# EAGLE design cataclysm-TOP (EAGLE 9.6.1)
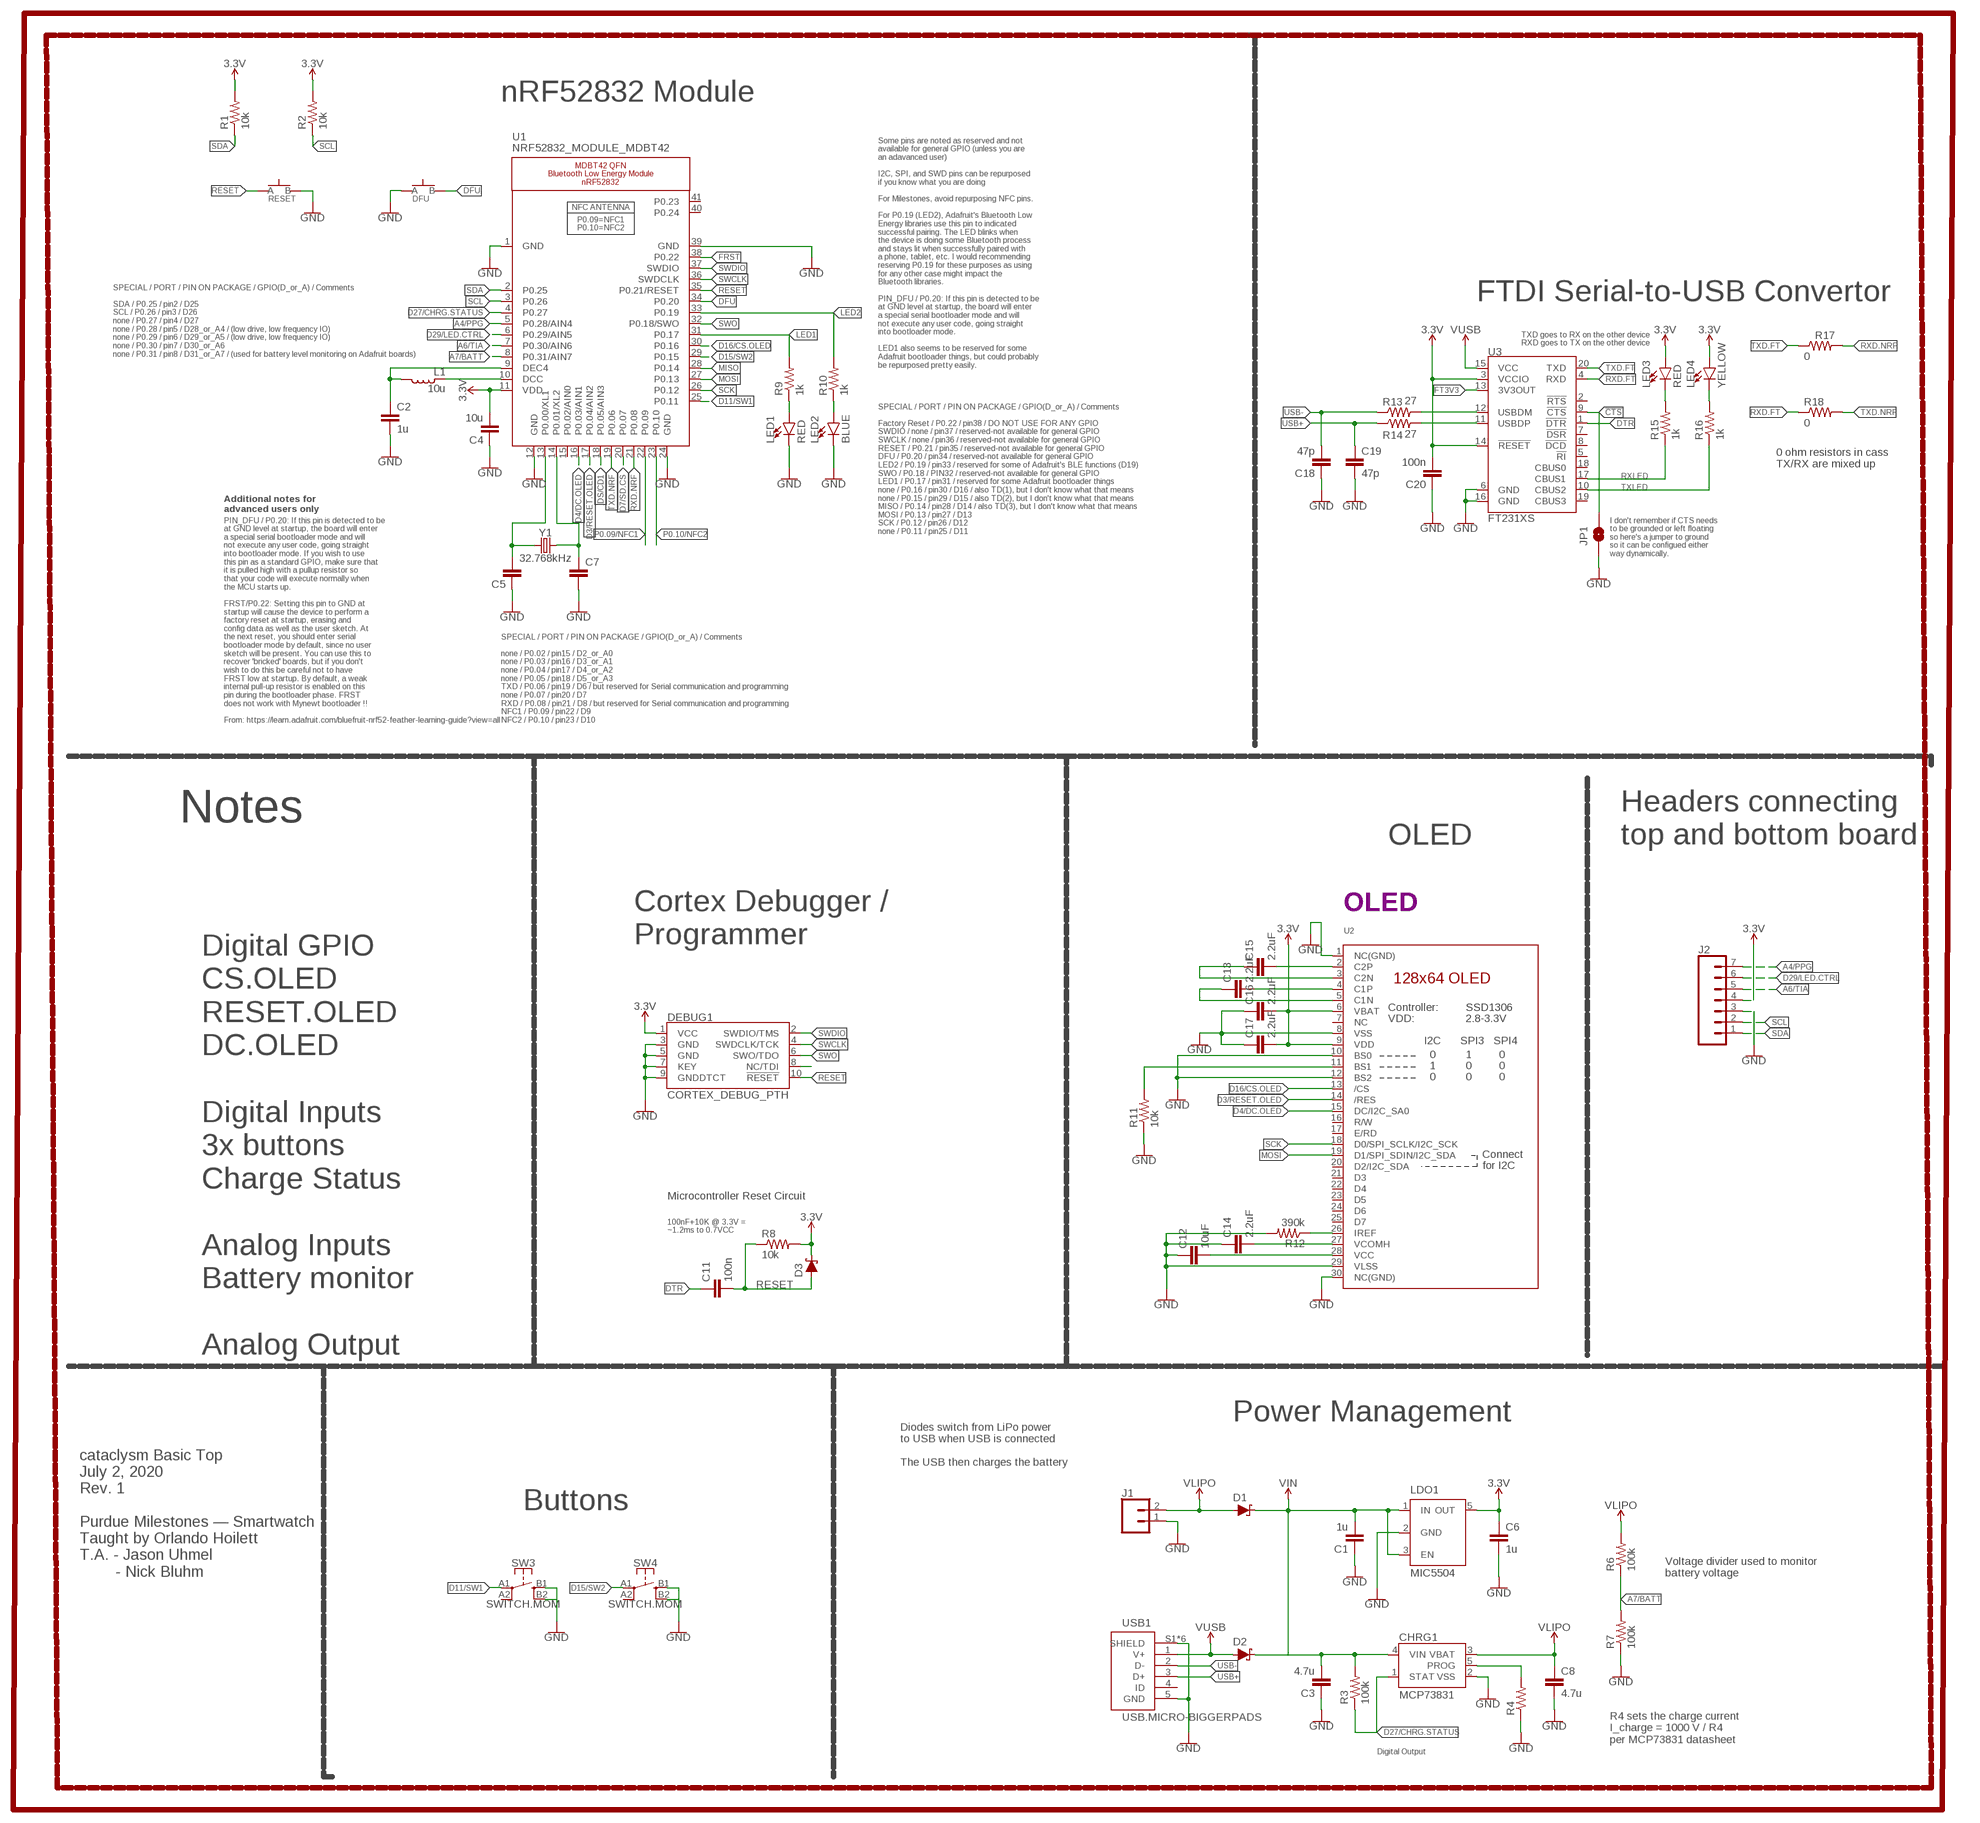
[diagram p0: schematic, sheet 1]

## Parts
C1  1u  CAPACITOR0603  [C0603]
C2  1u  CAPACITOR0603  [C0603]
C3  4.7u  CAPACITOR0603  [C0603]
C4  10u  CAPACITOR0805  [C0805]
C5  CAPACITOR0603  [C0603]
C6  1u  CAPACITOR0603  [C0603]
C7  CAPACITOR0603  [C0603]
C8  4.7u  CAPACITOR0603  [C0603]
C11  100n  CAPACITOR0603  [C0603]
C12  10uF  CAPACITOR0603  [C0603]
C13  2.2uF  CAPACITOR0402  [C0402]
C14  2.2uF  CAPACITOR0603  [C0603]
C15  2.2uF  CAPACITOR0402  [C0402]
C16  2.2uF  CAPACITOR0402  [C0402]
C17  2.2uF  CAPACITOR0402  [C0402]
C18  47p  CAPACITOR0603  [C0603]
C19  47p  CAPACITOR0603  [C0603]
C20  100n  CAPACITOR0603  [C0603]
CHRG1  MCP73831  [SOT23-5]
D1  SCHOTTKY-USC  [USC]
D2  SCHOTTKY-USC  [USC]
D3  SCHOTTKY-USC  [USC]
DEBUG1  CORTEX_DEBUG_PTH  [2X5-PTH-1.27MM]
DFU  SPST-PTS830GG140-COPY.1-3  [BUTTON-GULLWING]
J1  CONN_02  [1X02]
J2  CONN_07-1.27MM  [1X07_1.27MM]
JP1  JUMPER-SMT_2_NO_SILK  [SMT-JUMPER_2_NO_SILK]
L1  10u  INDUCTOR0603  [L0603]
LDO1  MIC5504  [SOT23-5]
LED1  RED  LED0603  [LED-0603]
LED2  BLUE  LED0603  [LED-0603]
LED3  RED  LED0603  [LED-0603]
LED4  YELLOW  LED0603  [LED-0603]
R1  10k  RESISTOR0603  [R0603]
R2  10k  RESISTOR0603  [R0603]
R3  100k  RESISTOR0603  [R0603]
R4  RESISTOR0603  [R0603]
R6  100k  RESISTOR0603  [R0603]
R7  100k  RESISTOR0603  [R0603]
R8  10k  RESISTOR0603  [R0603]
R9  1k  RESISTOR0603  [R0603]
R10  1k  RESISTOR0603  [R0603]
R11  10k  RESISTOR0603  [R0603]
R12  390k  RESISTOR0603  [R0603]
R13  27  RESISTOR0603  [R0603]
R14  27  RESISTOR0603  [R0603]
R15  1k  RESISTOR0603  [R0603]
R16  1k  RESISTOR0603  [R0603]
R17  0  RESISTOR0603  [R0603]
R18  0  RESISTOR0603  [R0603]
RESET  SPST-PTS830GG140-COPY.1-3  [BUTTON-GULLWING]
SW3  SWITCH.MOM  [TACTILE_SWITCH_SMD_6.2MM_TALL]
SW4  SWITCH.MOM  [TACTILE_SWITCH_SMD_6.2MM_TALL]
U1  NRF52832_MODULE_MDBT42  [BLE_MODULE_RAYTAC_MDBT42]
U2  DISP_OLED_UG-2864HSWEG01-NO-WRAPAROUND  [UG-2864HSWEG01_0.96IN_NO-WRAPAROUND]
U3  FT231XS  [SSOP20_L]
USB1  USB.MICRO-BIGGERPADS  [USB-MICRO-01.BIGGERPADS]
Y1  32.768kHz  CRYSTALECS-.327-12.5-12-C-TR  [2-SMD.NOLEAD.2.0MMTO1.2MM]

## Nets
3.3V: C4.2 C6.1 C16.2 C17.2 C20.2 D3.-(C) DEBUG1.1(VCC) J2.4 LDO1.5(OUT) LED3.A LED4.A R1.2 R2.2 R8.2 U1.11(VDD) U2.6(VBAT) U2.9(VDD) U3.3(VCCIO) U3.14(!RESET)
!CTS: JP1.2 U3.9(!CTS)
A4/PPG: J2.7 U1.5(P0.28/AIN4)
A6/TIA: J2.5 U1.7(P0.30/AIN6)
A7/BATT: R6.1 R7.2 U1.8(P0.31/AIN7)
D3/RESET.OLED: U1.17(P0.04/AIN2) U2.14(/RES)
D4/DC.OLED: U1.16(P0.03/AIN1) U2.15(DC/I2C_SA0)
D7/SD.CS: U1.20(P0.07)
D11/SW1: SW3.A1 U1.25(P0.11)
D15/SW2: SW4.A1 U1.29(P0.15)
D16/CS.OLED: U1.30(P0.16) U2.13(/CS)
D27/CHRG.STATUS: CHRG1.1(STAT) R3.1 U1.4(P0.27)
D29/LED.CTRL: J2.6 U1.6(P0.29/AIN5)
DFU: DFU.3(B) U1.34(P0.20)
DS/CD1: U1.18(P0.05/AIN3)
DTR: C11.1 U3.1(!DTR)
FRST: U1.38(P0.22)
FT3V3: U3.13(3V3OUT)
GND: C1.1 C2.2 C3.1 C4.1 C5.1 C6.2 C7.2 C8.2 C12.1 C14.1 C16.1 C17.1 C18.1 C19.2 C20.1 CHRG1.2(VSS) DEBUG1.3(GND) DEBUG1.5(GND) DEBUG1.7(KEY) DEBUG1.9(GNDDTCT) DFU.1(A) J1.1 J2.3 JP1.1 LDO1.2(GND) LED1.C LED2.C R4.1 R7.1 R11.1 R12.2 RESET.3(B) SW3.B1 SW4.B1 U1.1(GND) U1.12(GND) U1.24(GND) U1.39(GND) U2.1(NC(GND)) U2.8(VSS) U2.10(BS0) U2.12(BS2) U2.29(VLSS) U2.30(NC(GND)) U3.6(GND) U3.16(GND) USB1.5(GND) USB1.S1(SHIELD) USB1.S2(SHIELD) USB1.S3(SHIELD) USB1.S4(SHIELD) USB1.S5(SHIELD) USB1.S6(SHIELD)
LED1: R9.2 U1.31(P0.17)
LED2: R10.2 U1.33(P0.19)
MISO: U1.28(P0.14)
MOSI: U1.27(P0.13) U2.19(D1/SPI_SDIN/I2C_SDA)
N$1: R11.2 U2.11(BS1)
N$2: R12.1 U2.26(IREF)
N$3: C15.2 U2.2(C2P)
N$4: C5.2 U1.13(P0.00/XL1) Y1.P$1
N$5: C15.1 U2.3(C2N)
N$6: C7.1 U1.14(P0.01/XL2) Y1.P$2
N$7: C13.2 U2.4(C1P)
N$8: C13.1 U2.5(C1N)
N$9: LED1.A R9.1
N$10: LED2.A R10.1
N$11: L1.1 U1.10(DCC)
N$12: C2.1 L1.2 U1.9(DEC4)
N$13: C12.2 U2.28(VCC)
N$14: DEBUG1.8(NC/TDI)
N$15: C14.2 U2.27(VCOMH)
N$16: SW4.B2
N$17: CHRG1.5(PROG) R4.2
N$21: SW3.B2
N$25: R13.2 U3.12(USBDM)
N$26: R14.2 U3.11(USBDP)
N$27: LED3.C R15.2
N$28: LED4.C R16.2
P0.09/NFC1: U1.22(P0.09)
P0.10/NFC2: U1.23(P0.10)
RESET: C11.2 D3.+(A) DEBUG1.10(!RESET) R8.1 RESET.1(A) U1.35(P0.21/RESET)
RXD.FT: R18.1 U3.4(RXD)
RXD.NRF: R17.2 U1.21(P0.08)
RXLED: R15.1 U3.17(CBUS1)
SCK: U1.26(P0.12) U2.18(D0/SPI_SCLK/I2C_SCK)
SCL: J2.2 R2.1 U1.3(P0.26)
SDA: J2.1 R1.1 U1.2(P0.25)
SWCLK: DEBUG1.4(SWDCLK/TCK) U1.36(SWDCLK)
SWDIO: DEBUG1.2(SWDIO/TMS) U1.37(SWDIO)
SWO: DEBUG1.6(SWO/TDO) U1.32(P0.18/SWO)
TXD.FT: R17.1 U3.20(TXD)
TXD.NRF: R18.2 U1.19(P0.06)
TXLED: R16.1 U3.10(CBUS2)
USB+: C19.1 R14.1 USB1.3(D+)
USB-: C18.2 R13.1 USB1.2(D-)
V_USB: D2.+(A) U3.15(VCC) USB1.1(V+) ; supply symbol labelled VUSB
VIN: C1.2 C3.2 CHRG1.4(VIN) D1.-(C) D2.-(C) LDO1.1(IN) LDO1.3(EN) R3.2
VLIPO: C8.1 CHRG1.3(VBAT) D1.+(A) J1.2 R6.2
Unconnected: SW3.A2 SW4.A2 U1.15(P0.02/AIN0) U1.40(P0.24) U1.41(P0.23) U2.7(NC) U2.16(R/W) U2.17(E/RD) U2.20(D2/I2C_SDA) U2.21(D3) U2.22(D4) U2.23(D5) U2.24(D6) U2.25(D7) U3.2(!RTS) U3.5(!RI) U3.7(!DSR) U3.8(!DCD) U3.18(CBUS0) U3.19(CBUS3) USB1.4(ID)

## Notes on the sheet
- nRF52832 Module
- FTDI Serial-to-USB Convertor
- TXD goes to RX on the other device
  RXD goes to TX on the other device
- SPECIAL / PORT / PIN ON PACKAGE / GPIO(D_or_A) / Comments
  
  SDA / P0.25 / pin2 / D25
  SCL / P0.26 / pin3 / D26
  none / P0.27 / pin4 / D27
  none / P0.28 / pin5 / D28_or_A4 / (low drive, low frequency IO)
  none / P0.29 / pin6 / D29_or_A5 / (low drive, low frequency IO)
  none / P0.30 / pin7 / D30_or_A6
  none / P0.31 / pin8 / D31_or_A7 / (used for battery level monitoring on Adafruit boards)
- Some pins are noted as reserved and not
  available for general GPIO (unless you are
  an adavanced user)
  
  I2C, SPI, and SWD pins can be repurposed
  if you know what you are doing
  
  For Milestones, avoid repurposing NFC pins.
  
  For P0.19 (LED2), Adafruit's Bluetooth Low
  Energy libraries use this pin to indicated
  successful pairing. The LED blinks when
  the device is doing some Bluetooth process
  and stays lit when successfully paired with
  a phone, tablet, etc. I would recommending
  reserving P0.19 for these purposes as using
  for any other case might impact the
  Bluetooth libraries.
  
  PIN_DFU / P0.20: If this pin is detected to be
  at GND level at startup, the board will enter
  a special serial bootloader mode and will
  not execute any user code, going straight
  into bootloader mode.
  
  LED1 also seems to be reserved for some
  Adafruit bootloader things, but could probably
  be repurposed pretty easily.
- 0 ohm resistors in cass
  TX/RX are mixed up
- Additional notes for
  advanced users only
- SPECIAL / PORT / PIN ON PACKAGE / GPIO(D_or_A) / Comments
  
  Factory Reset / P0.22 / pin38 / DO NOT USE FOR ANY GPIO
  SWDIO / none / pin37 / reserved-not available for general GPIO
  SWCLK / none / pin36 / reserved-not available for general GPIO
  RESET / P0.21 / pin35 / reserved-not available for general GPIO
  DFU / P0.20 / pin34 / reserved-not available for general GPIO
  LED2 / P0.19 / pin33 / reserved for some of Adafruit's BLE functions (D19)
  SWO / P0.18 / PIN32 / reserved-not available for general GPIO
  LED1 / P0.17 / pin31 / reserved for some Adafruit bootloader things
  none / P0.16 / pin30 / D16 / also TD(1), but I don't know what that means
  none / P0.15 / pin29 / D15 / also TD(2), but I don't know what that means
  MISO / P0.14 / pin28 / D14 / also TD(3), but I don't know what that means
  MOSI / P0.13 / pin27 / D13
  SCK / P0.12 / pin26 / D12
  none / P0.11 / pin25 / D11
- I don't remember if CTS needs
  to be grounded or left floating
  so here's a jumper to ground
  so it can be configued either
  way dynamically.
- PIN_DFU / P0.20: If this pin is detected to be
  at GND level at startup, the board will enter
  a special serial bootloader mode and will
  not execute any user code, going straight
  into bootloader mode. If you wish to use
  this pin as a standard GPIO, make sure that
  it is pulled high with a pullup resistor so
  that your code will execute normally when
  the MCU starts up.
  
  FRST/P0.22: Setting this pin to GND at
  startup will cause the device to perform a
  factory reset at startup, erasing and
  config data as well as the user sketch. At
  the next reset, you should enter serial
  bootloader mode by default, since no user
  sketch will be present. You can use this to
  recover 'bricked' boards, but if you don't
  wish to do this be careful not to have
  FRST low at startup. By default, a weak
  internal pull-up resistor is enabled on this
  pin during the bootloader phase. FRST
  does not work with Mynewt bootloader !!
  
  From: https://learn.adafruit.com/bluefruit-nrf52-feather-learning-guide?view=all
- SPECIAL / PORT / PIN ON PACKAGE / GPIO(D_or_A) / Comments
  
  none / P0.02 / pin15 / D2_or_A0
  none / P0.03 / pin16 / D3_or_A1
  none / P0.04 / pin17 / D4_or_A2
  none / P0.05 / pin18 / D5_or_A3
  TXD / P0.06 / pin19 / D6 / but reserved for Serial communication and programming
  none / P0.07 / pin20 / D7
  RXD / P0.08 / pin21 / D8 / but reserved for Serial communication and programming
  NFC1 / P0.09 / pin22 / D9
  NFC2 / P0.10 / pin23 / D10
- Notes
- OLED
- Headers connecting
  top and bottom board
- OLED
- Cortex Debugger / 
  Programmer
- Microcontroller Reset Circuit
- 100nF+10K @ 3.3V =
  ~1.2ms to 0.7VCC
- Digital GPIO
  CS.OLED
  RESET.OLED
  DC.OLED
  
  Digital Inputs
  3x buttons
  Charge Status
  
  Analog Inputs
  Battery monitor
  
  Analog Output
- Power Management
- Diodes switch from LiPo power
  to USB when USB is connected
  
  The USB then charges the battery
- Buttons
- cataclysm Basic Top
  July 2, 2020
  Rev. 1
  
  Purdue Milestones — Smartwatch
  Taught by Orlando Hoilett
  T.A. - Jason Uhmel
          - Nick Bluhm
- Voltage divider used to monitor
  battery voltage
- R4 sets the charge current
  I_charge = 1000 V / R4
  per MCP73831 datasheet
- Digital Output

## Library data of the parts
C1-C8 C11-C20 = LinnesLab-Passives:CAPACITOR
CHRG1 = LinnesLab-Power:MCP73831: MCP73831T Li-Ion, Li-Pol Controller Miniature single cell, fully integrated Li-Ion, Li-polymer charge management controller Datasheet <http://ww1.microchip.com/downloads/en/DeviceDoc/20001984g.pdf> SparkFun Products: SparkFun ESP32 Thing <https://www.sparkfun.com/products/13907> SparkFun 9DoF Razor IMU M0 <https://www.sparkfun.com/products/14001>; PROD_ID: IC-09995
D1-D3 = LinnesLab-DiscreteSemi:SCHOTTKY: Schottky diode A Schottky diode is a semiconductor diode which has a low forward voltage drop and a very fast switching action. Example: Digi-Key Part Number: RB161MM-20CT-ND
DEBUG1 = LinnesLab-Connectors:CORTEX_DEBUG: Cortex Debug Connector - 10 pin Supports JTAG debug, Serial Wire debug, and Serial Wire Viewer. PTH and SMD connector options available. General Connector Information <http://infocenter.arm.com/help/topic/com.arm.doc.faqs/attached/13634/cortex_debug_connectors.pdf> Products: PTH Connector <http://www.digikey.com/product-detail/en/cnc-tech/3220-10-0100-00/1175-1627-ND/3883661> -via Digi-Key SparkFun PSoc <https://www.sparkfun.com/products/13229> SparkFun T <https://www.sparkfun.com/products/13810>
DFU RESET = LinnesLab-Switches:SPST-PTS830GG140-COPY
J1 = LinnesLab-Connectors:CONN_02: Multi connection point. Often used as Generic Header-pin footprint for 0.1 inch spaced/style header connections On any of the 0.1 inch spaced packages, you can populate with these: Break Away Headers - Straight <https://www.sparkfun.com/products/116> (PRT-00116) Break Away Male Headers - Right Angle <https://www.sparkfun.com/products/553> (PRT-00553) Female Headers <https://www.sparkfun.com/products/115> (PRT-00115) Break Away Headers - Machine Pin <https://www.sparkfun.com/products/117> (PRT-00117) Break Away Female Headers - Swiss Machine Pin <https://www.sparkfun.com/products/743> (PRT-00743) For SCREWTERMINALS and SPRING TERMINALS visit here: Screw Terimnals on SparkFun.com <https://www.sparkfun.com/search/results?term=Screw+Terminals> (5mm/3.5mm/2.54mm spacing) This device is also useful as a general connection point to wire up your design to another part of your project. Our various solder wires solder well into these plated through hole pads. Hook-Up Wire - Assortment (Stranded, 22 AWG) <https://www.sparkfun.com/products/11375> (PRT-11375) Hook-Up Wire - Assortment (Solid Core, 22 AWG) <https://www.sparkfun.com/products/11367> (PRT-11367) View the entire wire category on our website here <https://www.sparkfun.com/categories/141> Special notes: Molex polarized connector foot print use with: PRT-08233 with associated crimp pins and housings. 2.54_SCREWTERM for use with PRT-10571. 3.5mm Screw Terminal footprints for PRT-08084 5mm Screw Terminal footprints for use with PRT-08432
J2 = LinnesLab-Connectors:CONN_07: Multi connection point. Often used as Generic Header-pin footprint for 0.1 inch spaced/style header connections On any of the 0.1 inch spaced packages, you can populate with these: Break Away Headers - Straight <https://www.sparkfun.com/products/116> (PRT-00116) Break Away Male Headers - Right Angle <https://www.sparkfun.com/products/553> (PRT-00553) Female Headers <https://www.sparkfun.com/products/115> (PRT-00115) Break Away Headers - Machine Pin <https://www.sparkfun.com/products/117> (PRT-00117) Break Away Female Headers - Swiss Machine Pin <https://www.sparkfun.com/products/743> (PRT-00743) For SCREWTERMINALS and SPRING TERMINALS visit here: Screw Terimnals on SparkFun.com <https://www.sparkfun.com/search/results?term=Screw+Terminals> (5mm/3.5mm/2.54mm spacing) This device is also useful as a general connection point to wire up your design to another part of your project. Our various solder wires solder well into these plated through hole pads. Hook-Up Wire - Assortment (Stranded, 22 AWG) <https://www.sparkfun.com/products/11375> (PRT-11375) Hook-Up Wire - Assortment (Solid Core, 22 AWG) <https://www.sparkfun.com/products/11367> (PRT-11367) View the entire wire category on our website here <https://www.sparkfun.com/categories/141> Special notes: Molex polarized connector foot print use with SKU : PRT-08231 with associated crimp pins and housings. 1MM SMD Version SKU: PRT-10208 NOTES ON THE VARIANTS LOCK and LOCK_LONGPADS... This footprint was designed to help hold the alignment of a through-hole component (i.e. 6-pin header) while soldering it into place. You may notice that each hole has been shifted either up or down by 0.005 of an inch from it's more standard position (which is a perfectly straight line). This slight alteration caused the pins (the squares in the middle) to touch the edges of the holes. Because they are alternating, it causes a "brace" to hold the component in place. 0.005 has proven to be the perfect amount of "off-center" position when using our standard breakaway headers. Although looks a little odd when you look at the bare footprint, once you have a header in there, the alteration is very hard to notice. Also,if you push a header all the way into place, it is covered up entirely on the bottom side.
JP1 = LinnesLab-Switches:JUMPER-SMT_2_NO: Normally open jumper This jumper has two pads in close proximity to each other. Apply solder to close the connection. Round pads are easier to solder for beginners, but are a lot larger. SparkFun Product that uses the round pads: SparkFun EL Sequencer <https://www.sparkfun.com/products/12781>
L1 = LinnesLab-Passives:INDUCTOR
LDO1 = LinnesLab-Power:MIC5504: MIC5504 Voltage Regulator Output Voltages: 1.0V to 3.3V Input Voltages: 2.5V to 5.5V Link to Datasheet http://ww1.microchip.com/downloads/en/DeviceDoc/MIC550X.pdf
LED1-LED4 = LinnesLab-LED:LED: LED (Generic) Standard schematic elements and footprints for 5mm, 3mm, 1206, and 0603 sized LEDs. Generic LEDs with no color specified. LTST-C190KGKT: arrow indicates cathode
R1-R4 R6-R18 = LinnesLab-Passives:RESISTOR
SW3 SW4 = LinnesLab-Switches:SWITCH.MOM: PTS645SM43SMTR92 LFS
U1 = LinnesLab-Microcontrollers:NRF52832_MODULE_MDBT42: MDBT42 - BLE Module (nRF52832 QFN) VDD: 1.7-3.6V
U2 = LinnesLab-Displays:DISP_OLED_UG-2864HSWEG01: UG-2864HSWEG01 OLED display Both 1.3" and 0.96" models share the same FPC tab footprint, only the screen dimensions vary.
U3 = LinnesLab-DigitalIC:FT231X: FTDI FT231X Full Speed USB to Full-handshake UART This USB2.0 Full Speed IC offers a compact bridge to full handshake UART interfaces. The device is a UART, capable of operating up to 3MBaud, with low power consumption (8mA). The FT231X includes the complete FT-X series feature set and enables USB to be added into a system design quickly and easily over a UART interface. Datasheet <http://cdn.sparkfun.com/datasheets/Components/General%20IC/DS_FT231X.pdf>; DIGIKEY: 768-1156-5-ND; MFN: FT231XS-U
USB1 = LinnesLab-Connectors:USB.MICRO: DigiKey PN: 609-4613-1-ND
Y1 = LinnesLab-Clocks:CRYSTAL; DIGIKEY: XC2288CT-ND; FREQ: 32.7680KHZ; LOAD_CAP: 12.5pF

## Board
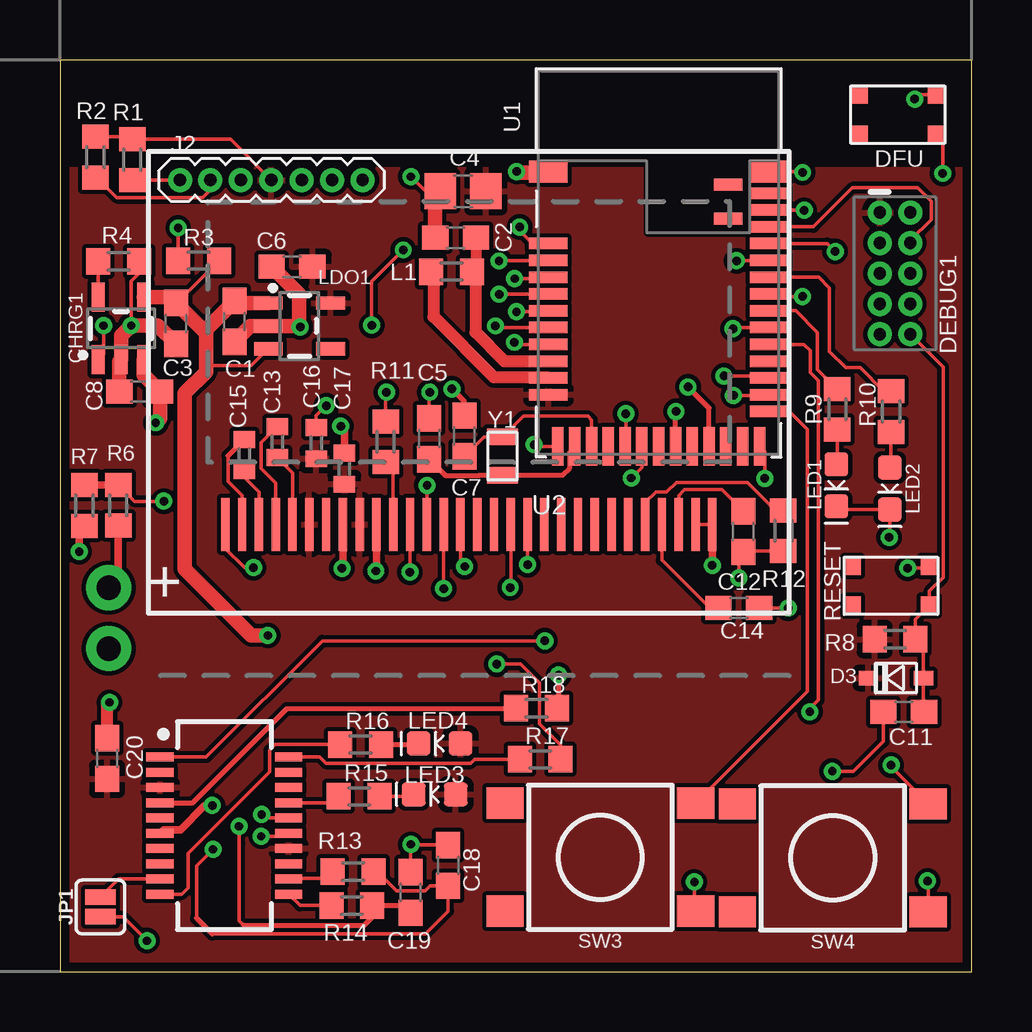
[diagram p1: board, top side]
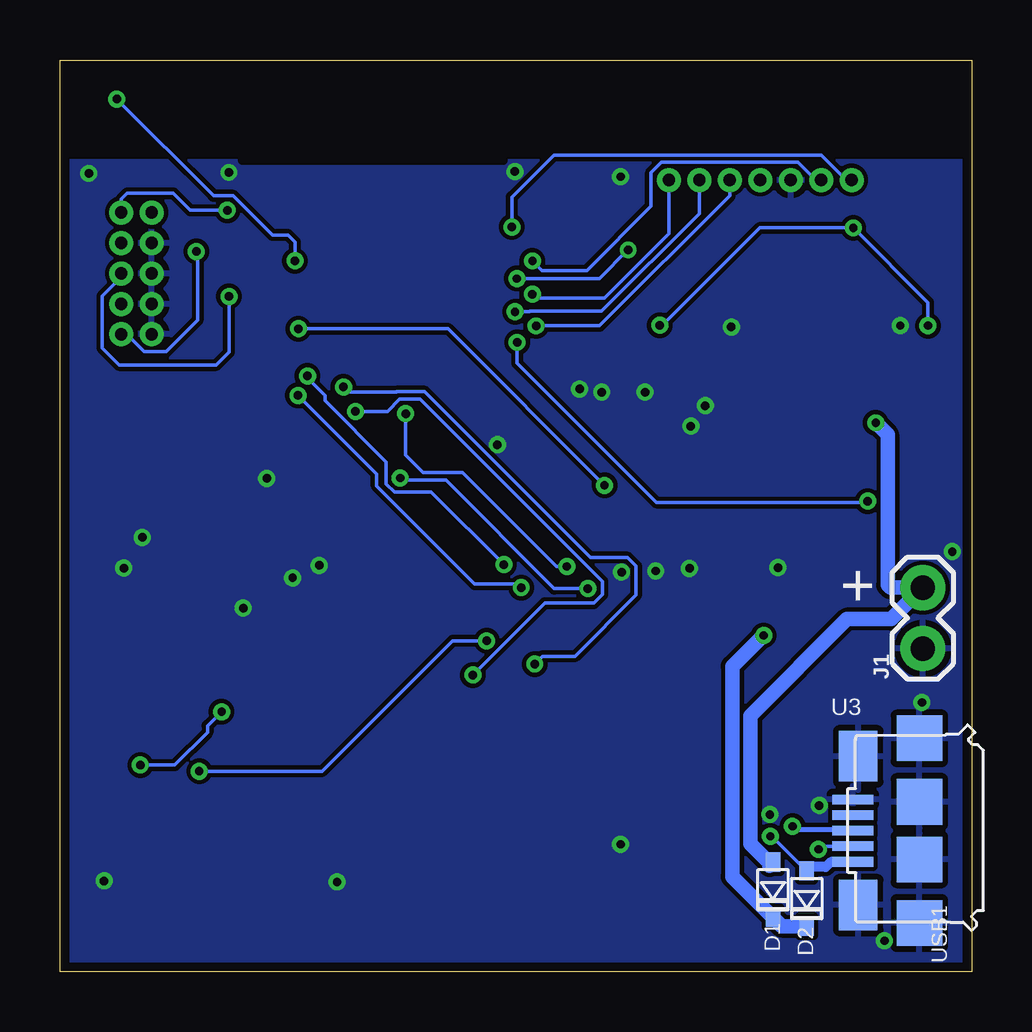
[diagram p2: board, bottom side, seen from below]

Size 38 x 38 mm. Coordinates in mm from the lower left corner, seen from the top.
Outline: 0,0 38,0 38,38 0,38 0,0
Copper layers (1*16): Top 0.0356mm / dielectric 1.5011mm / Bottom 0.0356mm
Design rules "LaenPCBOrder": minimum track width 6mil, minimum drill 13mil, track to track 6mil, track to pad 6mil, pad to pad 6mil, via to via 6mil, smd to smd 6mil, copper to edge 15mil, drill to drill 6mil, minimum pad ring 7mil, minimum via ring 7mil, stop-mask expansion 3mil, vias tented up to drill 0mil, thermal gap 10mil

### Footprints (pad centres in the part's own frame; a part is rotated, then mirrored left to right if it is on the bottom)
C0603 = smd 1.1 x 1: 1 -0.85,0; 2 0.85,0
C0805 = smd 1.3 x 1.5: 1 -0.95,0; 2 0.95,0
C0402 = smd 0.7 x 0.9: 1 -0.65,0; 2 0.65,0
SOT23-5 = smd 0.55 x 1.2: 1 -0.95,-1.3; 2 0,-1.3; 3 0.95,-1.3; 4 0.95,1.3; 5 -0.95,1.3
USC = smd 0.8 x 0.6: + -1.15,0; - 1.15,0
2X5-PTH-1.27MM = drill 0.508 pad 1: 1 -2.54,-0.635; 2 -2.54,0.635; 3 -1.27,-0.635; 4 -1.27,0.635; 5 0,-0.635; 6 0,0.635; 7 1.27,-0.635; 8 1.27,0.635; 9 2.54,-0.635; 10 2.54,0.635
BUTTON-GULLWING = smd 0.7 x 0.75: 1 -1.6,0.825; 2 1.6,0.825; 3 -1.6,-0.825; 4 1.6,-0.825
1X02 = drill 1.016 pad 1.88: 1 0,0; 2 2.54,0
1X07_1.27MM = drill 0.508 pad 1: 1 0,0; 2 1.27,0; 3 2.54,0; 4 3.81,0; 5 5.08,0; 6 6.35,0; 7 7.62,0
SMT-JUMPER_2_NO_SILK = smd 0.635 x 1.27: 1 -0.406,0; 2 0.406,0
L0603 = smd 1 x 1.1: 1 -0.85,0; 2 0.85,0
LED-0603 = smd 1 x 1: A -0.877,0; C 0.877,0
R0603 = smd 1 x 1.1: 1 -0.85,0; 2 0.85,0
TACTILE_SWITCH_SMD_6.2MM_TALL = smd 1.55 x 1.3: A1 -3.975,-2.25; A2 3.975,-2.25; B1 -3.975,2.25; B2 3.975,2.25
BLE_MODULE_RAYTAC_MDBT42 = smd 1.6 x 0.9: 1 -4.6,3.8; 39 4.6,3.8 | smd 1.6 x 0.48: 2 -4.6,0.8; 3 -4.6,0.1; 4 -4.6,-0.6; 5 -4.6,-1.3; 6 -4.6,-2; 7 -4.6,-2.7; 8 -4.6,-3.4; 9 -4.6,-4.1; 10 -4.6,-4.8; 11 -4.6,-5.5; 25 4.6,-6.2; 26 4.6,-5.5; 27 4.6,-4.8; 28 4.6,-4.1; 29 4.6,-3.4; 30 4.6,-2.7; 31 4.6,-2; 32 4.6,-1.3; 33 4.6,-0.6; 34 4.6,0.1; 35 4.6,0.8; 36 4.6,1.5; 37 4.6,2.2; 38 4.6,2.9 | smd 0.48 x 1.6: 12 -4.2,-7.65; 13 -3.5,-7.65; 14 -2.8,-7.65; 15 -2.1,-7.65; 16 -1.4,-7.65; 17 -0.7,-7.65; 18 0,-7.65; 19 0.7,-7.65; 20 1.4,-7.65; 21 2.1,-7.65; 22 2.8,-7.65; 23 3.5,-7.65; 24 4.2,-7.65 | smd 1.2 x 0.5: 40 2.9,3.25; 41 2.9,1.85
UG-2864HSWEG01_0.96IN_NO-WRAPAROUND = smd 0.35 x 2.2: 1 -10.15,-1.2; 2 -9.45,-1.2; 3 -8.75,-1.2; 4 -8.05,-1.2; 5 -7.35,-1.2; 6 -6.65,-1.2; 7 -5.95,-1.2; 8 -5.25,-1.2; 9 -4.55,-1.2; 10 -3.85,-1.2; 11 -3.15,-1.2; 12 -2.45,-1.2; 13 -1.75,-1.2; 14 -1.05,-1.2; 15 -0.35,-1.2; 16 0.35,-1.2; 17 1.05,-1.2; 18 1.75,-1.2; 19 2.45,-1.2; 20 3.15,-1.2; 21 3.85,-1.2; 22 4.55,-1.2; 23 5.25,-1.2; 24 5.95,-1.2; 25 6.65,-1.2; 26 7.35,-1.2; 27 8.05,-1.2; 28 8.75,-1.2; 29 9.45,-1.2; 30 10.15,-1.2
SSOP20_L = smd 0.381 x 1.143: 1 -2.857,-2.68; 2 -2.223,-2.68; 3 -1.587,-2.68; 4 -0.953,-2.68; 5 -0.318,-2.68; 6 0.318,-2.68; 7 0.953,-2.68; 8 1.587,-2.68; 9 2.223,-2.68; 10 2.857,-2.68; 11 2.857,2.68; 12 2.223,2.68; 13 1.587,2.68; 14 0.953,2.68; 15 0.318,2.68; 16 -0.318,2.68; 17 -0.953,2.68; 18 -1.587,2.68; 19 -2.223,2.68; 20 -2.857,2.68
USB-MICRO-01.BIGGERPADS = smd 0.4 x 1.7: 1 -1.3,1.505; 2 -0.65,1.505; 3 0,1.505; 4 0.65,1.505; 5 1.3,1.505 | smd 1.9 x 1.9: S1 -3.85,-1.27; S2 -1.2,-1.27; S3 1.2,-1.27; S4 3.85,-1.27 | smd 2.1 x 1.6: S5 -3.1,1.28; S6 3.1,1.28
2-SMD.NOLEAD.2.0MMTO1.2MM = smd 0.7 x 1.3: P$1 -0.8,0; P$2 0.8,0

### Placement (x,y rotation side)
C1  7.28,27.1 90 top
C2  16.49,30.6 180 top
C3  4.84,27.02 90 top
C4  16.8,32.52 0 top
C5  15.39,22.21 270 top
C6  9.67,29.39 180 top
C7  16.86,22.33 90 top
C8  3.32,24.18 180 top
C11  35.17,10.82 0 top
C12  28.49,18.34 90 top
C13  9.06,22.07 90 top
C14  28.3,15.16 180 top
C15  7.69,21.53 90 top
C16  10.68,22.03 270 top
C17  11.85,20.96 270 top
C18  16.18,4.42 270 top
C19  14.62,3.3 90 top
C20  1.96,8.88 270 top
CHRG1  2.55,26.81 0 top
D1  8.28,3.41 270 bottom
D2  6.87,3.05 270 bottom
D3  34.85,12.23 180 top
DEBUG1  34.81,29.1 270 top
DFU  34.92,35.72 180 top
J1  2.03,13.46 90 bottom
J2  5,33 0 top
JP1  1.68,2.69 90 top
L1  16.32,29.17 0 top
LDO1  9.98,26.91 270 top
LED1  32.36,20.27 270 top
LED2  34.59,20.14 270 top
LED3  15.62,7.39 180 top
LED4  15.82,9.51 180 top
R1  3.01,33.84 90 top
R2  1.48,33.94 90 top
R3  5.78,29.63 0 top
R4  2.45,29.6 180 top
R6  2.43,19.44 270 top
R7  1.02,19.43 90 top
R8  34.81,13.85 180 top
R9  32.4,23.44 90 top
R10  34.65,23.34 90 top
R11  13.58,22.09 270 top
R12  30.15,18.37 270 top
R13  12.22,4.17 180 top
R14  12.16,2.75 180 top
R15  12.47,7.31 0 top
R16  12.53,9.46 0 top
R17  20.02,8.85 0 top
R18  19.86,10.98 0 top
RESET  34.64,16.08 180 top
SW3  22.52,4.77 180 top
SW4  32.21,4.73 180 top
U1  24.96,29.55 0 top
U2  17.04,19.84 0 top
U3  6.85,6.08 270 top
USB1  3.44,5.87 90 bottom
Y1  18.45,21.49 90 top

### Tracks (layer width: path | path; a pad name or v marks a point on that pad's centre or on a via)
3.3V
  Top 0.152: J2.4 7.12,34.69 R1.2 2.91,34.8 R2.2
  pour Top (isolate 0.178): 37.82,33.47 37.82,0.28 0.15,0.28 0.15,33.47
!CTS
  Top 0.152: JP1.2 2.44,3.86 U3.9
A4/PPG  (via drill 0.35)
  Top 0.152: U1.5 18.32,28.25 v18.31,28.23
  Bottom 0.152: v18.31,28.23 18.16,28.08 15.29,28.08 12.62,30.75 J2.7
A6/TIA  (via drill 0.35)
  Top 0.152: U1.7 18.22,26.84 v18.15,26.92
  Bottom 0.152: v18.15,26.92 15.5,26.92 10.08,32.34 J2.5
A7/BATT  (via drill 0.35)
  Top 0.152: U1.8 19.02,26.14 v18.94,26.23 | v4.33,19.61 v4.32,19.6 3.12,19.6 R6.1
  Top 0.305: R6.1 2.42,20.28 R7.2
  Bottom 0.152: v18.94,26.23 18.94,25.36 13.14,19.55 4.38,19.55 v4.33,19.61
D3/RESET.OLED  (via drill 0.35)
  Top 0.152: U2.14 v15.99,15.97 | v23.82,20.57 24.26,21.01 U1.17
  Bottom 0.152: v15.99,15.97 17.4,15.97 21.91,20.48 23.73,20.48 v23.82,20.57
D4/DC.OLED  (via drill 0.35)
  Top 0.152: U2.15 16.69,17.06 v16.87,16.88 | v23.59,23.26 23.59,21.92 U1.16
  Bottom 0.152: v16.87,16.88 17.3,16.88 21.22,20.81 22.86,20.81 23.59,21.53 v23.59,23.26
D11/SW1
  Top 0.152: SW3.A1 31.15,11.67 31.15,22.6 30.4,23.34 U1.25
D15/SW2  (via drill 0.35)
  Top 0.152: SW4.A1 36.19,7 34.61,8.57 v34.65,8.61 | U1.29 31.02,26.14 31.28,25.89 31.28,24.98 31.62,24.63 31.62,11.32 31.26,10.96 v31.26,10.82
  Bottom 0.152: v31.26,10.82 31.84,10.24 31.84,9.98 33.21,8.61 v34.65,8.61
D16/CS.OLED  (via drill 0.35)
  Top 0.152: U2.13 v15.29,20.26 v15.3,20.27 | v28.06,26.8 28.11,26.84 U1.30
  Bottom 0.152: v28.06,26.8 21.83,26.8 v15.3,20.27
D27/CHRG.STATUS  (via drill 0.35)
  Top 0.152: R3.1 v4.93,31 | v1.82,26.93 1.82,25.73 CHRG1.1 | U1.4 20.3,28.89 v18.95,28.89 | v14.31,30.08 12.99,28.76 v12.99,26.94
  Bottom 0.152: v1.82,26.93 1.82,27.89 v4.93,31 8.82,31 12.88,26.94 v12.99,26.94 | v18.95,28.89 15.51,28.89 v14.31,30.08
D29/LED.CTRL  (via drill 0.35)
  Top 0.152: U1.6 20.32,27.51 v19.03,27.51
  Bottom 0.152: v19.03,27.51 18.42,27.51 18.4,27.52 15.42,27.52 11.35,31.59 J2.6
DFU  (via drill 0.35)
  Top 0.152: U1.34 28.22,29.64 v28.21,29.63 | v35.63,36.37 35.8,36.54 DFU.3
  Bottom 0.152: v28.21,29.63 28.21,30.42 28.5,30.71 29.14,30.71 30.77,32.34 31.6,32.34 v35.63,36.37
DTR  (via drill 0.35)
  Top 0.152: U3.1 6.1,8.94 10.95,13.79 v20.21,13.79 | v32.2,8.35 33.08,8.35 34.32,9.59 C11.1
  Bottom 0.152: v20.21,13.79 21.63,13.79 27.08,8.35 v32.2,8.35
GND  (via drill 0.35)
  Top 0.152: v8.07,16.84 7.69,16.84 6.89,17.63 U2.1 | R11.1 13.58,24.12 v13.61,24.15 | C19.2 v14.62,5.29 | v14.62,5.29 v14.63,5.3 | C18.1 14.64,5.28 v14.62,5.29 | v15.42,24.15 15.39,24.12 C5.1 | U1.12 19.83,21.89 v19.77,21.96 | U2.29 U2.30 | R12.2 28.52,17.52 C12.1 28.3,17.3 v28.3,16.41 | SW4.B1 36.19,3.75 v36.16,3.78 | SW3.B1 26.45,2.57 v26.45,3.73 | RESET.3 36.15,16.82 v35.34,16.82 | U2.12 v14.59,16.66 | v34.56,18.1 34.59,18.13 LED2.C 32.5,19.26 LED1.C | C16.1 10.68,23.17 v11.1,23.59 | U1.39 30.92,33.34 v30.96,33.31 | v36.8,33.27 36.8,35.16 DFU.1 | U1.24 29.38,21.67 v29.38,20.56 | C14.1 29.04,15.15 v30.36,15.15 | C4.1 15.24,32.52 v14.63,33.14 | JP1.1 2.63,2.29 v3.63,1.28 | U3.16 8.55,6.4 v8.4,6.54 | R4.1 3.3,29.11 2.96,28.77 v2.96,26.93
  Top 0.2: C7.2 16.86,23.76 v16.34,24.29 | C18.1 16.31,5.41
  Top 0.305: U2.8 11.79,16.84 v11.76,16.81 | U2.10 13.19,16.72 v13.17,16.7 | v14.59,16.66 v14.59,16.65 | U2.30 v27.19,16.93 | v27.19,16.93 | C17.1 11.85,22.59 v11.71,22.73 | U3.6 4.31,5.91 5.02,5.91 6.02,6.9 6.33,6.9 v6.35,6.92 | R7.1 0.8,18.36 v0.8,17.51
  Top 0.508: C20.1 1.96,11.11 v2.07,11.22
  Top 0.61: C2.2 15.64,32.31 C4.1 | U1.1 20.32,33.31 19.08,33.31 v19.04,33.35 | C8.2 2.48,25.44 CHRG1.2 2.55,26.51 v2.96,26.93 | v2.96,26.93 v2.97,26.93 | C3.1 4.08,26.93 v2.96,26.93 | C1.1 7.94,26.91 LDO1.2 9.98,26.91 | 9.98,26.91 v10.02,26.87 | C6.2 9.98,28.23 9.98,26.91
  pour Bottom (isolate 0.178): 0.13,33.8 0.13,0.2 37.64,0.2 37.64,33.8
LED1
  Top 0.152: R9.2 31.58,25.1 31.58,26.63 30.67,27.55 U1.31
LED2
  Top 0.152: R10.2 34.33,24.19 33.35,25.17 32.76,25.17 32.08,25.85 32.08,28.49 31.63,28.95 U1.33
MOSI  (via drill 0.35)
  Top 0.152: U2.19 v19.49,16.96 | v27.68,24.83 29.48,24.83 U1.27
  Bottom 0.152: v19.49,16.96 22.53,19.99 24.06,19.99 24.4,20.33 24.4,21.25 26.95,23.8 26.95,24 27.68,24.73 v27.68,24.83
N$1
  Top 0.152: R11.2 13.58,21.16 13.88,20.86 13.88,18.65 U2.11
N$2
  Top 0.152: R12.1 29.83,19.22 28.65,20.39 25.69,20.39 25.29,19.99 24.84,19.99 24.39,19.54 U2.26
N$3
  Top 0.152: 7.59,18.78 7.59,19.85 7.01,20.43 7.01,21.5
  Top 0.2: 7.01,21.5 C15.2 | U2.2 7.59,18.78
N$4
  Top 0.152: C5.2 15.39,21.2
  Top 0.2: U1.13 21.48,21.87 21.25,21.64 21.25,20.99 20.95,20.69 Y1.P$1 17.48,20.69 17.47,20.67 16.08,20.67 C5.2
N$5
  Top 0.152: C15.1 7.61,20.67 8.29,19.98 U2.3
N$6
  Top 0.152: U1.14 22.16,23 22.01,23.15 19.32,23.15 18.47,22.29 Y1.P$2 17.68,22.29 C7.1
N$7
  Top 0.152: U2.4 8.99,20.37 8.38,20.98 8.38,22.04 C13.2
N$8
  Top 0.152: C13.1 9.69,20.79 U2.5
N$9
  Top 0.152: R9.1 32.4,21.18 LED1.A
N$10
  Top 0.152: R10.1 34.65,21.07 LED2.A
N$11
  Top 0.508: L1.1 15.56,29.08 15.56,27.3 18.09,24.77 20.33,24.77 U1.10
N$12
  Top 0.457: L1.2 17.34,29.34 C2.1
  Top 0.508: L1.2 17.31,29.03 17.31,26.65 18.52,25.45 U1.9
N$13
  Top 0.152: C12.2 27.59,20.09 26.03,20.09 25.79,19.85 U2.28
N$15
  Top 0.152: U2.27 25.09,17.15 27.08,15.16 C14.2
N$17
  Top 0.152: R4.2 CHRG1.5
N$25
  Top 0.152: U3.12 9.57,3.89 11.1,3.89 R13.2
N$26
  Top 0.152: R14.2 10.01,2.75 U3.11
N$27
  Top 0.152: R15.2 14.66,7.31 LED3.C
N$28
  Top 0.2: R16.2 14.9,9.46 LED4.C
RESET  (via drill 0.35)
  Top 0.152: DEBUG1.10 36.82,25.19 36.82,16.44 36.24,15.86 RESET.1 35.66,14.68 R8.1 36,13.52 D3.+ 36,10.85 C11.2 | U1.35 31.98,30.34 v32.31,30.01
  Bottom 0.152: DEBUG1.10 35.22,26.56 34.49,25.83 33.58,25.83 32.26,27.15 32.26,29.83 32.31,29.88 v32.31,30.01
RXD.FT
  Top 0.2: R18.1 18.99,10.95 9.45,10.95 5.52,7.02 4.19,7.02 U3.4
RXD.NRF  (via drill 0.35)
  Top 0.152: R17.2 20.87,9.45 19.98,10.33 19.98,12.03 19.19,12.82 v18.21,12.82
  Top 0.2: U1.21 27.06,23.5 v26.18,24.37
  Bottom 0.152: v26.18,24.37 25.98,24.16 23.97,24.16 23.96,24.17 22.8,24.17 15.89,17.26 14.34,17.26 13.98,16.9 13.98,15.7 16.54,13.14 17.88,13.14 v18.21,12.82
RXLED
  Top 0.152: U3.17 11.35,7.04 R15.1
SCK  (via drill 0.35)
  Top 0.152: U2.18 18.79,16.02 v18.77,16 | v28.08,24.01 29.53,24.01 U1.26
  Bottom 0.152: v18.77,16 18.77,16.07 18.85,16.15 20.71,16.15 24.8,20.24 24.8,20.74 v28.08,24.01
SCL  (via drill 0.35)
  Top 0.152: U1.3 20.34,29.63 18.6,29.63 18.45,29.48 v18.3,29.62 | R2.1 1.54,33.09 2.37,32.26 5.94,32.26 5.95,32.25 6.27,32.57 J2.2
  Bottom 0.152: J2.2 6.5,33 7.24,33.74 12.93,33.74 13.36,33.3 13.36,31.9 16.04,29.22 17.9,29.22 v18.3,29.62
SDA  (via drill 0.35)
  Top 0.152: U1.2 19.7,30.34 19.16,30.89 v19.16,31.04 | J2.1 R1.1
  Bottom 0.152: J2.1 5.23,33 6.27,34.04 17.41,34.04 19.16,32.29 v19.16,31.04
SWCLK
  Top 0.152: U1.36 31.41,31.05 33.03,32.67 35.77,32.67 36.32,32.12 36.32,31.35 35.45,30.48 DEBUG1.4
SWDIO  (via drill 0.35)
  Top 0.152: v31.03,31.73 29.57,31.73 U1.37
  Bottom 0.152: DEBUG1.2 35.45,32.19 35.2,32.44 33.28,32.44 32.57,31.73 v31.03,31.73
SWO  (via drill 0.35)
  Top 0.152: v30.95,28.14 29.66,28.14 U1.32
  Bottom 0.152: DEBUG1.6 35.45,28.95 36.24,28.15 36.24,25.99 35.53,25.29 31.48,25.29 30.95,25.82 v30.95,28.14
TXD.FT
  Top 0.152: R17.1 17.28,8.85 17.11,8.69 11.09,8.69 10.83,8.94 U3.20
TXD.NRF  (via drill 0.35)
  Top 0.2: U1.19 25.66,23.33 v25.68,23.35 | v20.79,12.36 20.79,11.05 R18.2
  Bottom 0.152: v20.79,12.36 17.78,15.36 15.74,15.36 15.39,15.71 15.39,16.27 22.98,23.86 23.84,23.86 24.35,23.35 v25.68,23.35
TXLED
  Top 0.152: U3.10 5.07,3.23 5.33,3.49 5.33,4.92 8.73,8.32 8.73,9.23 8.97,9.46 R16.1
USB+  (via drill 0.35)
  Top 0.152: 7.65,1.93 7.47,2.11 7.47,5.34 7.46,5.35 v7.46,6.05
  Top 0.2: 7.65,1.93 7.66,1.92 12.68,1.92 13.01,2.26 R14.1 14.53,2.75 C19.1
  Bottom 0.2: v7.46,6.05 7.34,5.94 5.01,5.94 USB1.3
USB-  (via drill 0.35)
  Top 0.152: 6.35,1.57 15.24,1.57 16.18,2.51 C18.2 15.42,3.58 15.21,3.37 14.03,3.37 13.23,4.17 R13.1 | v6.38,5.09 5.69,4.41 5.69,2.23
  Top 0.2: 5.69,2.23 6.35,1.57
  Bottom 0.152: v6.38,5.09 6.25,5.22 USB1.2
V_USB  (via drill 0.35)
  Top 0.152: U3.15 9.4,5.64 v8.39,5.64
  Bottom 0.152: v8.39,5.64 8.33,5.64 6.89,4.2 D2.+
  Bottom 0.406: USB1.1 5.86,4.57 6.07,4.36 6.71,4.36 D2.+
VIN  (via drill 0.35)
  Top 0.152: R3.2 4.87,27.87 C3.2 | LDO1.3 7.98,25.25 6.08,25.25
  Top 0.61: v8.66,14.01 7.98,14.01 5.2,16.78 5.2,24.12 6.08,25 6.08,25.25 6.08,26.62 | CHRG1.4 4.59,28.11 C3.2 6.08,26.62 | 6.08,26.62 6.08,26.76 C1.2 7.37,27.86 LDO1.1
  Bottom 0.61: D2.- 7.92,1.9 D1.- 9.98,3.96 9.98,12.72 8.69,14.01 v8.66,14.01
VLIPO  (via drill 0.35)
  Top 0.305: R6.2 2.43,16.4 J1.2
  Top 0.61: v3.99,22.88 4.17,23.06 C8.1 3.5,24.86 CHRG1.3
  Bottom 0.61: D1.+ 8.42,4.42 8.42,4.52 9.21,5.32 9.21,10.67 5.19,14.69 3.34,14.69 J1.2 3.39,16 3.5,16.11 3.5,22.38 v3.99,22.88

### Text on the board
tNames: +
bNames: +